# EAGLE design Pololu Magnetic Encoder (AS5035) (EAGLE 6.4)
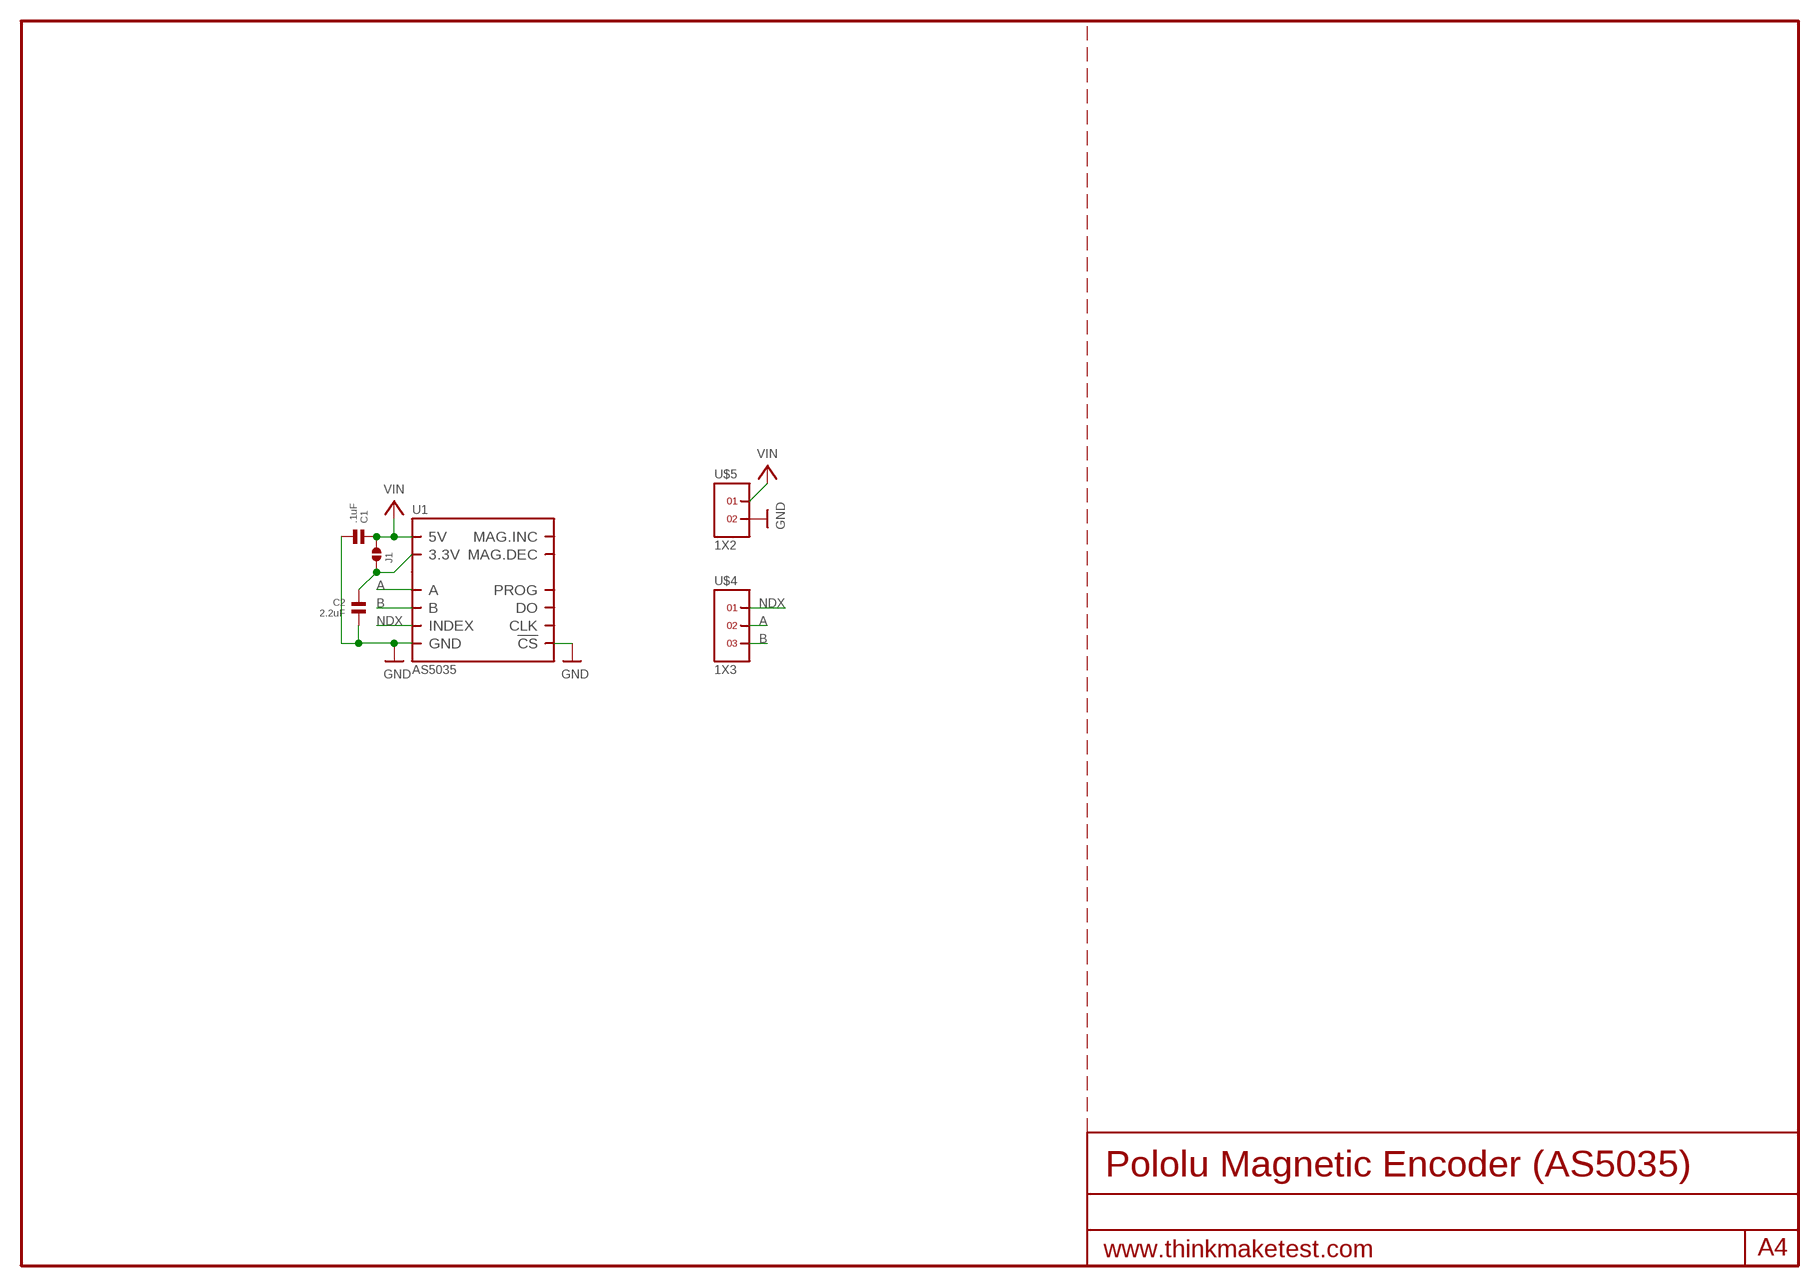
[diagram p0: schematic, sheet 1]

## Parts
C1  .1uF  CAPACITOR.0603  [0603]
C2  2.2uF  CAPACITOR.0603  [0603]
J1  SOLDERJUMPER.2.LRG.PASTE  [2.LRG.PASTE]
U1  AS5035  [SSOP16]
U$4  1X3  [1X3]
U$5  1X2  [1X2]

## Nets
A: U1.3(A) U$4.2
B: U1.4(B) U$4.3
GND: C1.2 C2.2 U1.7(GND) U1.11(!CS) U$5.2
N$4: C2.1 J1.1 U1.15(3.3V)
NDX: U1.6(INDEX) U$4.1
VIN: C1.1 J1.2 U1.16(5V) U$5.1
Unconnected: U1.1(MAG.INC) U1.2(MAG.DEC) U1.8(PROG) U1.9(DO) U1.10(CLK)

## Library data of the parts
C1 C2 = .standardparts:CAPACITOR
J1 = .solderjumper:SOLDERJUMPER.2
U1 = austriamicrosystems:AS5035
U$4 = headers(.1in):1X3
U$5 = headers(.1in):1X2

## Board
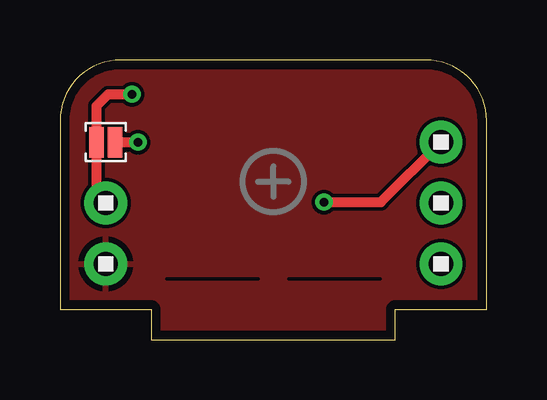
[diagram p1: board, top side]
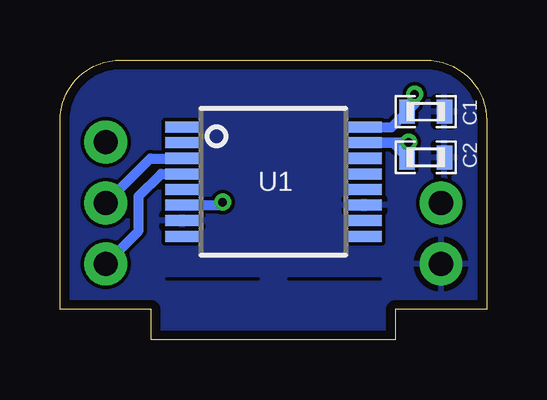
[diagram p2: board, bottom side, seen from below]

Size 17.78 x 11.68 mm. Coordinates in mm from the lower left corner, seen from the top.
Outline: 0,1.27 3.81,1.27 3.81,0 13.97,0 13.97,1.27 17.78,1.27 17.78,9.14 arc90 15.24,11.68 2.54,11.68 arc90 0,9.14 0,1.27
Copper layers (1*16): Top 0.0356mm / dielectric 1.5011mm / Bottom 0.0356mm
Design rules "OSHPark": minimum track width 6mil, minimum drill 13mil, track to track 6mil, track to pad 6mil, pad to pad 6mil, via to via 6mil, smd to smd 6mil, copper to edge 15mil, drill to drill 6mil, minimum pad ring 7mil, minimum via ring 7mil, stop-mask expansion 0mil, vias tented up to drill 16mil, thermal gap 10mil
tRestrict: 2 lines
bRestrict: 2 lines

### Footprints (pad centres in the part's own frame; a part is rotated, then mirrored left to right if it is on the bottom)
0603 = smd 0.65 x 1: 1 -0.775,0; 2 0.775,0
2.LRG.PASTE = smd 0.61 x 1.27: 1 -0.381,0; 2 0.381,0
SSOP16 = smd 0.46 x 1.43: 1 -2.275,-3.795; 2 -1.625,-3.795; 3 -0.975,-3.795; 4 -0.325,-3.795; 5 0.325,-3.795; 6 0.975,-3.795; 7 1.625,-3.795; 8 2.275,-3.795; 9 2.275,3.795; 10 1.625,3.795; 11 0.975,3.795; 12 0.325,3.795; 13 -0.325,3.795; 14 -0.975,3.795; 15 -1.625,3.795; 16 -2.275,3.795
1X3 = drill 1.016 pad 1.778: 1 0,0; 2 2.54,0; 3 5.08,0
1X2 = drill 1.016 pad 1.778: 1 0,0; 2 2.54,0

### Placement (x,y rotation side)
C1  2.54,9.53 0 bottom
C2  2.54,7.62 0 bottom
J1  1.91,8.26 180 top
U1  8.89,6.6 270 bottom
U$4  15.88,8.26 270 top
U$5  1.91,5.71 270 top

### Tracks (layer width: path | path; a pad name or v marks a point on that pad's centre or on a via)
A
  Bottom 0.406: U$4.2 14.01,7.58 U1.3
B
  Bottom 0.406: U$4.3 14.5,4.55 14.5,6 13.57,6.93 U1.4
GND
  pour Bottom (rank 6): 0,0 17.78,0 17.78,11.68 0,11.68
  pour Top (rank 6): 0,0 17.78,0 17.78,11.68 0,11.68
N$4  (via drill 0.36)
  Top 0.406: J1.1 v3.25,8.25
  Bottom 0.406: C2.1 3.92,8.23 U1.15 3.27,8.23 v3.25,8.25
NDX  (via drill 0.36)
  Top 0.406: v11,5.75 13.37,5.75 U$4.1
  Bottom 0.406: U1.6 11.12,5.63 v11,5.75
VIN  (via drill 0.36)
  Top 0.406: U$5.1 1.52,6.1 J1.2 1.52,9.77 2,10.25 v3,10.25
  Bottom 0.406: U1.16 3.96,8.88 C1.1 3,9.84 v3,10.25 | 1.99,5.63 U$5.1

### Text on the board
tDocu: 3.3v | Magnetic / QEI Encoder | INDEX | Vin | A | GND | B
bDocu: Cruz Monrreal II | AnomalousMaker.com